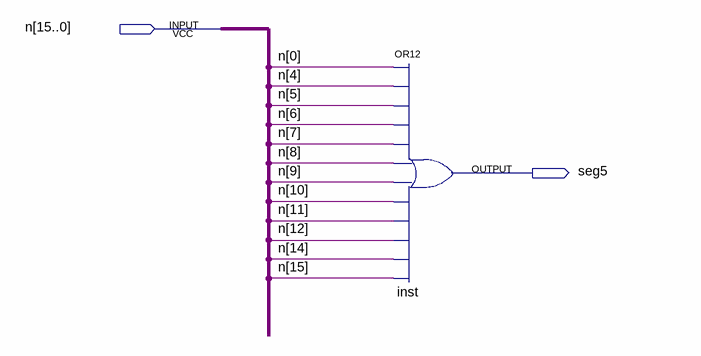
[diagram p0: schematic sheet]
// Quartus schematic seg5.bdf as structural Verilog: 1 symbols, 2 pins
module seg5 (
  input  [15:0] n,
  output seg5
);

  or inst (seg5, n[0], n[4], n[5], n[6], n[7], n[8], n[9], n[10], n[11], n[12], n[14], n[15]);
endmodule
